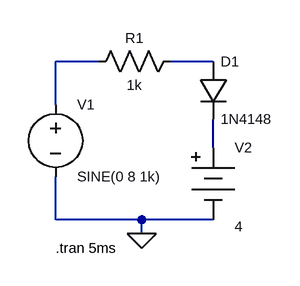
[diagram p0: schematic 2. Clipper Circuit.asc]
2. Clipper Circuit.asc, the LTspice schematic file:
Version 4
SHEET 1 880 680
WIRE 96 96 48 96
WIRE 224 96 176 96
WIRE 48 144 48 96
WIRE 224 192 224 160
WIRE 48 272 48 224
WIRE 144 272 48 272
WIRE 224 272 144 272
WIRE 144 288 144 272
FLAG 144 288 0
SYMBOL voltage 48 128 R0
WINDOW 123 0 0 Left 0
WINDOW 39 0 0 Left 0
WINDOW 0 24 16 Left 1
WINDOW 3 24 96 Left 1
SYMATTR InstName V1
SYMATTR Value SINE(0 8 1k)
SYMBOL res 192 80 R90
WINDOW 0 0 56 VBottom 1
WINDOW 3 32 56 VTop 1
SYMATTR InstName R1
SYMATTR Value 1k
SYMBOL diode 208 96 R0
WINDOW 0 24 0 Left 1
WINDOW 3 24 64 Left 1
SYMATTR InstName D1
SYMATTR Value 1N4148
SYMBOL Misc\\battery 224 176 R0
WINDOW 123 0 0 Left 0
WINDOW 39 0 0 Left 0
WINDOW 0 24 16 Left 1
WINDOW 3 24 104 Left 1
SYMATTR InstName V2
SYMATTR Value 4
TEXT 48 304 Left 1 !.tran 5ms

The netlist it stands for:
* 2. Clipper Circuit.asc
V1 N001 0 SINE(0 8 1k)
R1 N002 N001 1k
D1 N002 N003 1N4148
V2 N003 0 4
.model D D
.lib standard.dio
.tran 5ms
.backanno
.end